# Altium schematic sheet Connectivity_V2.SchDoc: Connectivity
size 420 x 297 mm
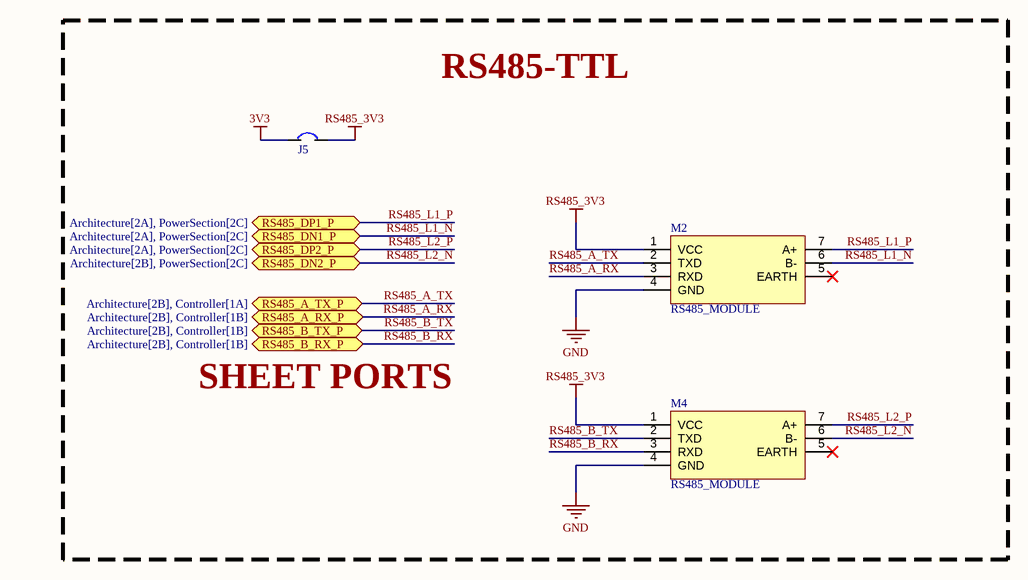
[diagram p0: Connectivity_V2.SchDoc]

## Parts
J5  Jumper_2P  [Jumper_2P]  (value not drawn)  (no BOM)
M2  value RS485_MODULE  [TTL-RS485]  (hidden comment: ERP_140-3)
M4  value RS485_MODULE  [TTL-RS485]  (hidden comment: ERP_140-3)

## Ports
RS485_A_RX_P (bidir, see Architecture[2B], Controller[1B]), RS485_A_TX_P (bidir, see Architecture[2B], Controller[1A]), RS485_B_RX_P (bidir, see Architecture[2B], Controller[1B]), RS485_B_TX_P (bidir, see Architecture[2B], Controller[1B]), RS485_DN1_P (bidir, see Architecture[2A], PowerSection[2C]), RS485_DN2_P (bidir, see Architecture[2B], PowerSection[2C]), RS485_DP1_P (bidir, see Architecture[2A], PowerSection[2C]), RS485_DP2_P (bidir, see Architecture[2A], PowerSection[2C])

## Nets
3V3: J5.1
GND: M2.4(GND) M4.4(GND)
RS485_3V3: J5.2 M2.1(VCC) M4.1(VCC)
RS485_A_RX: M2.3(RXD) ; port RS485_A_RX_P
RS485_A_TX: M2.2(TXD) ; port RS485_A_TX_P
RS485_B_RX: M4.3(RXD) ; port RS485_B_RX_P
RS485_B_TX: M4.2(TXD) ; port RS485_B_TX_P
RS485_L1_N: M2.6(B-) ; port RS485_DN1_P
RS485_L1_P: M2.7(A+) ; port RS485_DP1_P
RS485_L2_N: M4.6(B-) ; port RS485_DN2_P
RS485_L2_P: M4.7(A+) ; port RS485_DP2_P

Not connected (* = marked no-connect by the designer): M2 5(EARTH)*; M4 5(EARTH)*

## Notes on the sheet
- RS485-TTL
- SHEET PORTS
- PROJECT
- SIZE
- FILE NAME
- A3
- TITLE
- SHEET
- OF
- REV

## Library data of the parts
J5 = Jumper_2P: Jumper 2 Pins
M2 M4 = TTL-RS485: Manufacturer 1: Generic; Manufacturer Part Number 1: Generic